# Altium schematic sheet EC800X.SchDoc
size A3; CheckedBy: Danny.Wu; DrawnBy: Vae.Liu; Revision: V1.2; Code: SMART-EVB-G2
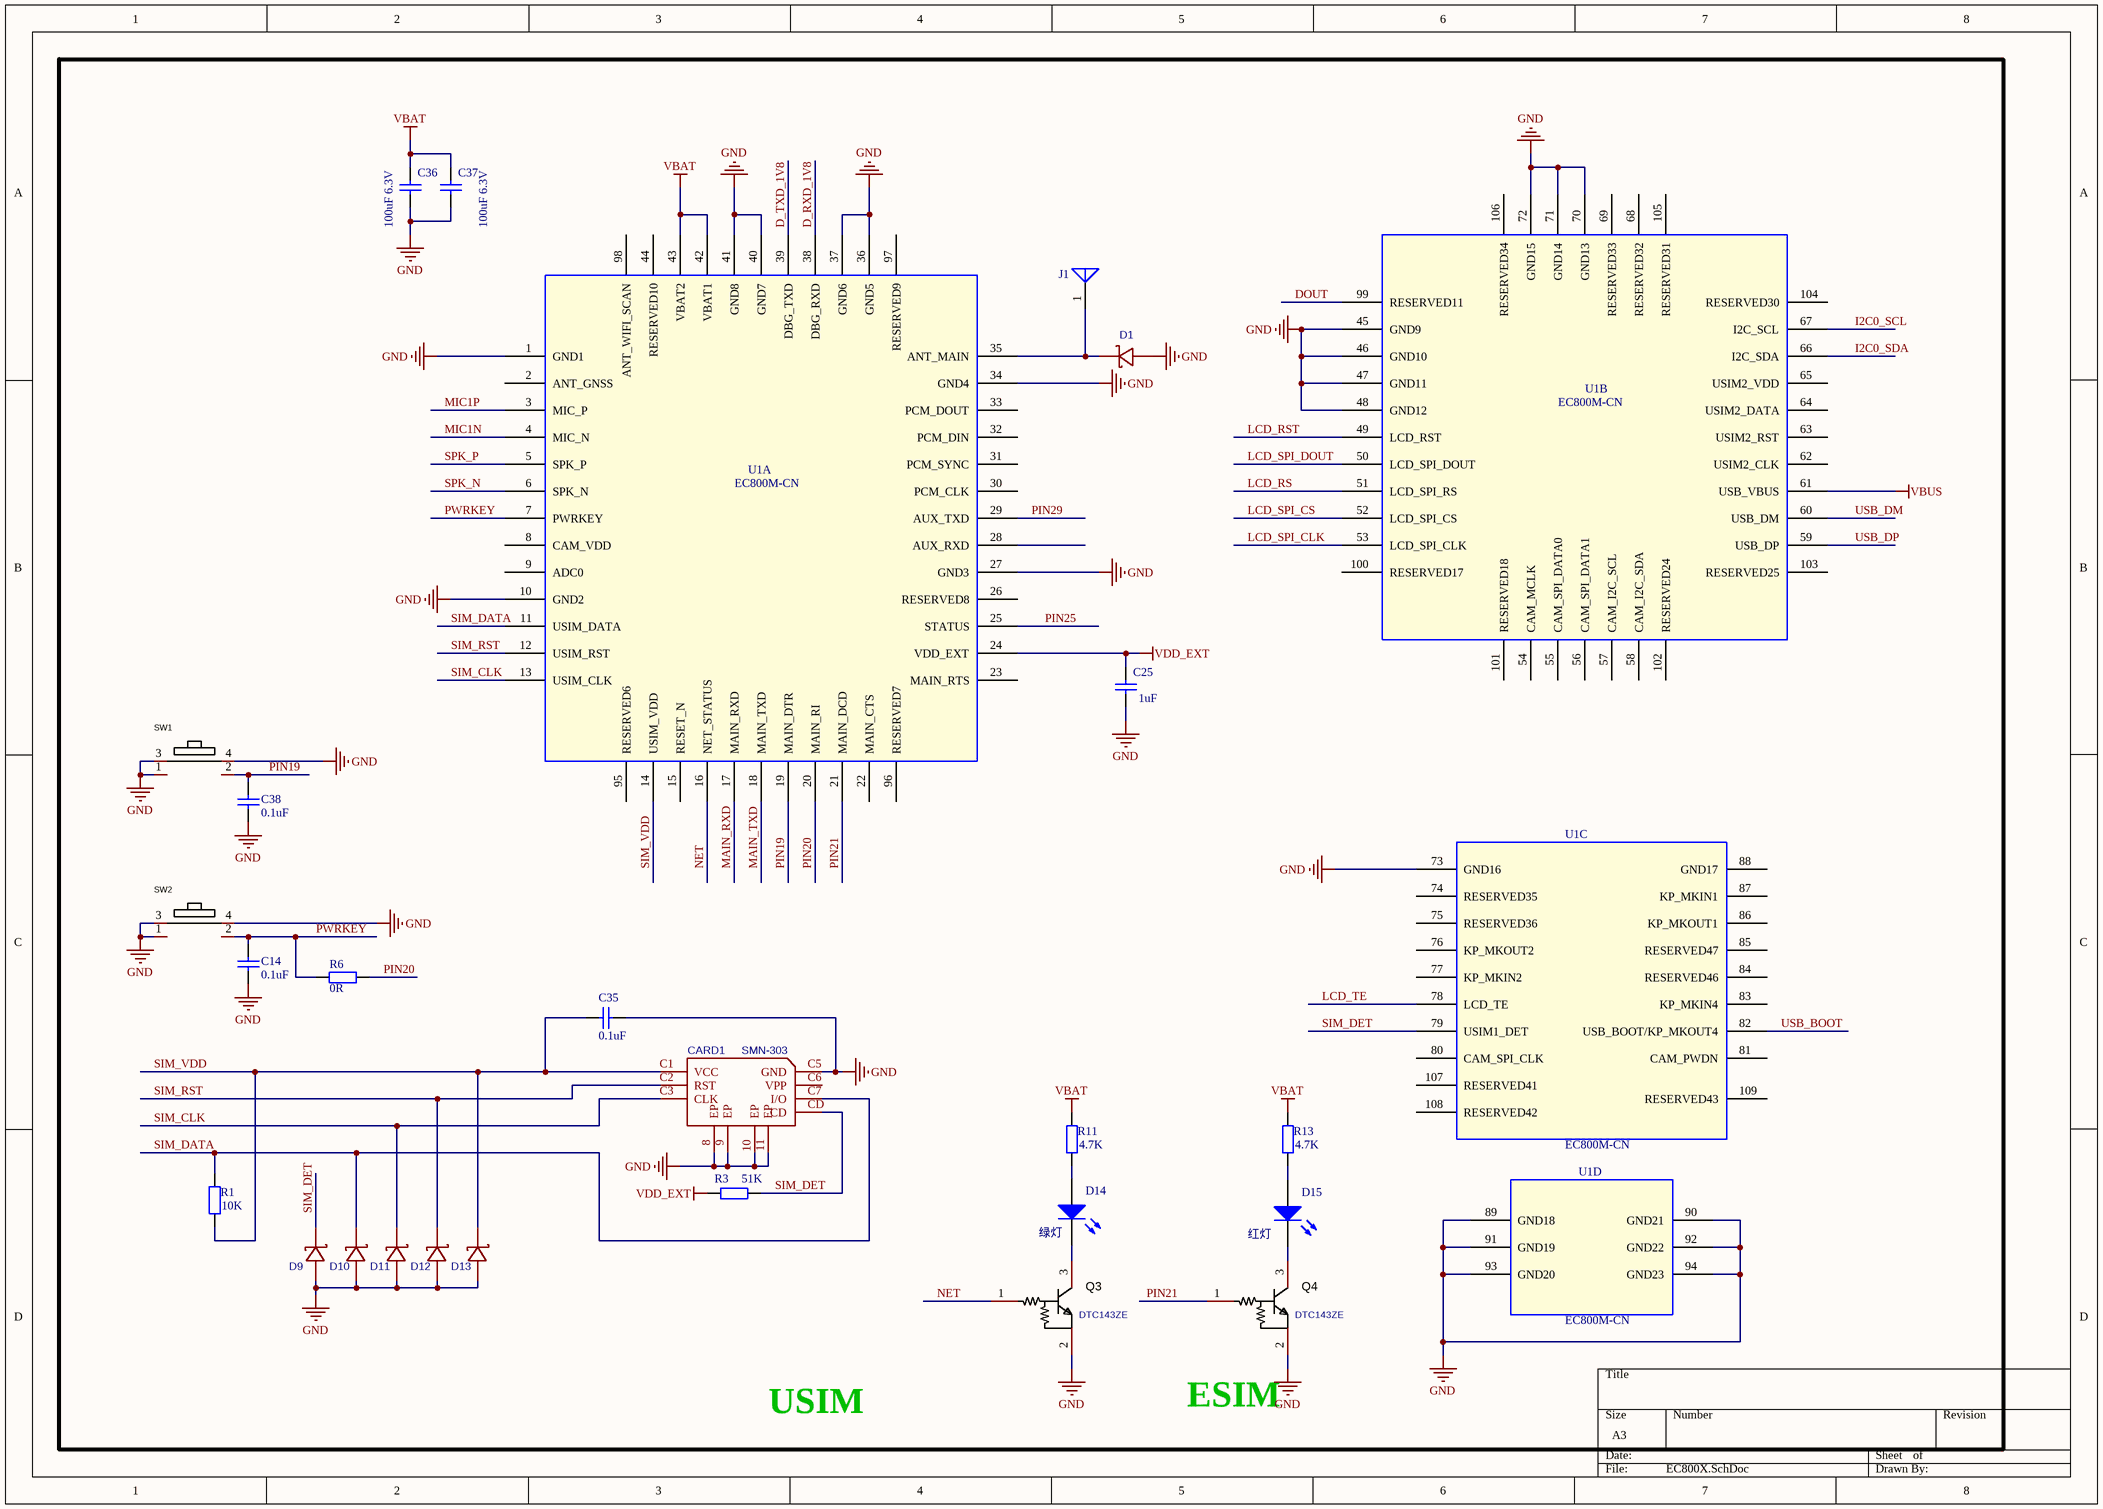
[diagram p0: EC800X.SchDoc]

## Parts
C14  0.1uF  [0402C]
C25  1uF  [0402C]
C35  0.1uF  [0402C]
C36  100uF 6.3V  [1206C]
C37  100uF 6.3V  [1206C]
C38  0.1uF  [0402C]
CARD1  SMN-303  [SIM-SMD_SMN-303]
D1  SLPESD0402M24  [SOD-882_L1.0-W0.6-RD]  (value not drawn)
D9  LESD8LL5.0T5G  [SOD-882_L1.0-W0.6-RD]  (value not drawn)
D10  LESD8LL5.0T5G  [SOD-882_L1.0-W0.6-RD]  (value not drawn)
D11  LESD8LL5.0T5G  [SOD-882_L1.0-W0.6-RD]  (value not drawn)
D12  LESD8LL5.0T5G  [SOD-882_L1.0-W0.6-RD]  (value not drawn)
D13  LESD8LL5.0T5G  [SOD-882_L1.0-W0.6-RD]  (value not drawn)
D14  value 绿灯  [LED-0603_GR]  (hidden comment: XL-1608UGC-04)
D15  value 红灯  [LED-0603_RD]  (hidden comment: XL-1608SURC-06)
J1  ANT  [IPEX天线]  (value not drawn)
Q3  DTC143ZE  [SOT-523]
Q4  DTC143ZE  [SOT-523]
R1  10K  [0402R]
R3  51K  [0402R]
R6  0R  [0402R]
R11  4.7K  [0402R]
R13  4.7K  [0402R]
SW1  TS-1101VS-C-A-A  [KEY-SMD_TS-1101VS-C-A-A]  (value not drawn)
SW2  TS-1101VS-C-A-A  [KEY-SMD_TS-1101VS-C-A-A]  (value not drawn)
U1  EC800M-CN  [EC801E-CN - 03]  (parts A,B,C,D of 4)

## Nets
GND: C14.1 C25.1 C35.2 C36.2 C37.2 C38.1 CARD1.8(EP) CARD1.9(EP) CARD1.10(EP) CARD1.11(EP) CARD1.C5(GND) D1.2(A) D9.2(A) D10.2(A) D11.2(A) D12.2(A) D13.2(A) J1.2 J1.3 Q3.2(E) Q4.2(E) SW1.1 SW1.3 SW1.4 SW2.1 SW2.3 SW2.4 U1.1(GND1) U1.10(GND2) U1.27(GND3) U1.34(GND4) U1.36(GND5) U1.37(GND6) U1.40(GND7) U1.41(GND8) U1.45(GND9) U1.46(GND10) U1.47(GND11) U1.48(GND12) U1.70(GND13) U1.71(GND14) U1.72(GND15) U1.73(GND16) U1.89(GND18) U1.90(GND21) U1.91(GND19) U1.92(GND22) U1.93(GND20) U1.94(GND23)
VBAT: C36.1 C37.1 R11.2 R13.2 U1.42(VBAT1) U1.43(VBAT2)
VBUS: U1.61(USB_VBUS)
VDD_EXT: C25.2 R3.2 U1.24(VDD_EXT)
D_RXD_1V8: U1.38(DBG_RXD)
D_TXD_1V8: U1.39(DBG_TXD)
DOUT: U1.99(RESERVED11)
I2C0_SCL: U1.67(I2C_SCL)
I2C0_SDA: U1.66(I2C_SDA)
LCD_RS: U1.51(LCD_SPI_RS)
LCD_RST: U1.49(LCD_RST)
LCD_SPI_CLK: U1.53(LCD_SPI_CLK)
LCD_SPI_CS: U1.52(LCD_SPI_CS)
LCD_SPI_DOUT: U1.50(LCD_SPI_DOUT)
LCD_TE: U1.78(LCD_TE)
MAIN_RXD: U1.17(MAIN_RXD)
MAIN_TXD: U1.18(MAIN_TXD)
MIC1N: U1.4(MIC_N)
MIC1P: U1.3(MIC_P)
NET: Q3.1(B) U1.16(NET_STATUS)
PIN19: C38.2 SW1.2 U1.19(MAIN_DTR)
PIN20: R6.1 U1.20(MAIN_RI)
PIN21: Q4.1(B) U1.21(MAIN_DCD)
PIN25: U1.25(STATUS)
PIN29: U1.29(AUX_TXD)
PWRKEY: C14.2 R6.2 SW2.2 U1.7(PWRKEY)
SIM_CLK: CARD1.C3(CLK) D11.1(C) U1.13(USIM_CLK)
SIM_DATA: CARD1.C7(I/O) D10.1(C) R1.2 U1.11(USIM_DATA)
SIM_DET: CARD1.CD D9.1(C) R3.1 U1.79(USIM1_DET)
SIM_RST: CARD1.C2(RST) D12.1(C) U1.12(USIM_RST)
SIM_VDD: C35.1 CARD1.C1(VCC) D13.1(C) R1.1 U1.14(USIM_VDD)
SPK_N: U1.6(SPK_N)
SPK_P: U1.5(SPK_P)
USB_BOOT: U1.82(USB_BOOT/KP_MKOUT4)
USB_DM: U1.60(USB_DM)
USB_DP: U1.59(USB_DP)
NetD1_1: D1.1(C) J1.1(A) U1.35(ANT_MAIN)
NetD14_1: D14.1(A) R11.1
NetD14_2: D14.2(K) Q3.3(C)
NetD15_1: D15.1(A) R13.1
NetD15_2: D15.2(K) Q4.3(C)

Not connected (* = marked no-connect by the designer): CARD1 C6(VPP); U1 2(ANT_GNSS) 8(CAM_VDD) 9(ADC0) 15(RESET_N) 22(MAIN_CTS) 23(MAIN_RTS) 26(RESERVED8) 28(AUX_RXD) 30(PCM_CLK) 31(PCM_SYNC) 32(PCM_DIN) 33(PCM_DOUT) 44(RESERVED10) 54(CAM_MCLK) 55(CAM_SPI_DATA0) 56(CAM_SPI_DATA1) 57(CAM_I2C_SCL) 58(CAM_I2C_SDA) 62(USIM2_CLK) 63(USIM2_RST) 64(USIM2_DATA) 65(USIM2_VDD) 68(RESERVED32) 69(RESERVED33) 74(RESERVED35) 75(RESERVED36) 76(KP_MKOUT2) 77(KP_MKIN2) 80(CAM_SPI_CLK) 81(CAM_PWDN) 83(KP_MKIN4) 84(RESERVED46) 85(RESERVED47) 86(KP_MKOUT1) 87(KP_MKIN1) 88(GND17) 95(RESERVED6) 96(RESERVED7) 97(RESERVED9) 98(ANT_WIFI_SCAN) 100(RESERVED17) 101(RESERVED18) 102(RESERVED24) 103(RESERVED25) 104(RESERVED30) 105(RESERVED31) 106(RESERVED34) 107(RESERVED41) 108(RESERVED42) 109(RESERVED43)

## Notes on the sheet
- USIM
- (near Q4) ESIM

## Library data of the parts
C14 C25 C35-C38 = Cap: Capacitor; Published: 8-Jun-2000; LatestRevisionDate: 17-Jul-2002; LatestRevisionNote: Re-released for DXP Platform.; PackageReference: RAD-0.3; Publisher: Altium Limited
CARD1 = SMN-303: SIM CARD; BOM_Manufacturer: XUNPU; Contributor: LCSC; BOM_Supplier: LCSC; BOM_Supplier Part: C266888; BOM_Manufacturer Part: SMN-303; spicePre: C; spiceSymbolName: SMN-303
D1 D9-D13 = LESD8LL5.0T5G: ESD; BOM_Manufacturer: LRC; Contributor: LCSC; BOM_Supplier: LCSC; BOM_JLCPCB Part Class: Extended Part; spicePre: D; spiceSymbolName: LESD8LL5.0T5G
  D1: BOM_Supplier Part: C513483; BOM_Manufacturer Part: SLPESD0402M24
  D9-D13: BOM_Supplier Part: C172423; BOM_Manufacturer Part: LESD8LL5.0T5G
D14 D15 = LED0: Typical INFRARED GaAs LED; Published: 8-Jun-2000; LatestRevisionDate: 08-Jul-2005; LatestRevisionNote: Mech Layer 1 removed.; PackageReference: LED-0; Publisher: Altium Limited
J1 = ANT: Antenna
Q3 Q4 = DTC143ZE_C248787: NPN; Manufacturer: TC(德昌); Add into BOM: yes; Power Dissipation (Pd): 150mW; Collector-Emitter Breakdown Voltage (Vceo): 50V; Collector Cut-Off Current (Icbo): 100nA; DC Current Gain (hFE@Ic,Vce): 350@10mA,5V; Transistor Type: 1个NPN-预偏置; Collector Current (Ic): 100mA; Collector-Emitter Saturation Voltage (VCE(sat)@Ic,Ib): 250mV@10mA,1mA; Input Resistor: 4.7kΩ; Name: DTC143ZE; Symbol: DTC143ZE_C248787; Device: DTC143ZE_C248787; LCSC Part Name: 电流:100mA 耐压:50V; Supplier Part: C248787; Manufacturer Part: DTC143ZE; Supplier Footprint: SOT-523-3; JLCPCB Part Class: Extended Part; Datasheet: https://atta.szlcsc.com/upload/public/pdf/source/20180801/C261279_47256D58AC18E2E55271AE832C186250.pdf; Supplier: LCSC; Convert to PCB: yes; Transition Frequency (fT): -; Input Voltage (VI(on)@Ic,Vce): -; Input Voltage (VI(off)@Ic,Vce): -; Output Voltage (VO(on)@Io/Ii): -; Resistor Ratio: -; Operating Temperature: -55℃~+150℃@(Tj)
R1 R3 R6 R11 R13 = Res2: Resistor; Published: 8-Jun-2000; LatestRevisionDate: 17-Jul-2002; LatestRevisionNote: Re-released for DXP Platform.; PackageReference: AXIAL-0.4; Publisher: Altium Limited
SW1 SW2 = TS-1101VS-C-A-A: SWITCH; Manufacturer: XKB Connectivity(中国星坤); Add into BOM: yes; Circuit: 单刀单掷; Actuator Style: 矩形按钮; Operating Force: 260gf; Switch Length: 7mm; Switch Width: 2.5mm; Switch Height: 3.5mm; Strike Gundam: 不带; Contact Current: 50mA; Voltage Rating (DC): 12V; Actuator/Cap Color: 黑色; With Lamp: 无; Mechanical Life: 5万次; Symbol: TS-1101VS-C-A-A; Device: TS-1101VS-C-A-A; LCSC Part Name: 7*2.5*3.5mm 卧贴 轻触开关; Supplier Part: C318936; Manufacturer Part: TS-1101VS-C-A-A; Supplier Footprint: SMD; JLCPCB Part Class: Extended Part; Datasheet: https://atta.szlcsc.com/upload/public/pdf/source/20211011/3EC7F7473F2EE0EB3A7179674E79B771.pdf; Supplier: LCSC; Convert to PCB: yes; Mounting Style: 卧贴; Insulation Resistance: -; Operating Temperature: -30℃~+85℃
U1 = EC800G-CN: EC800G-CN Moudle 109PIN 15.8X17.7mm H2.4mm RO; Manufacturer: Quectel; Geometry.Height: 2.4mm; Part Description: EC800G-CN Moudle 109PIN 15.8X17.7mm H2.4mm RO; PCB Footprint: EC800G-CN